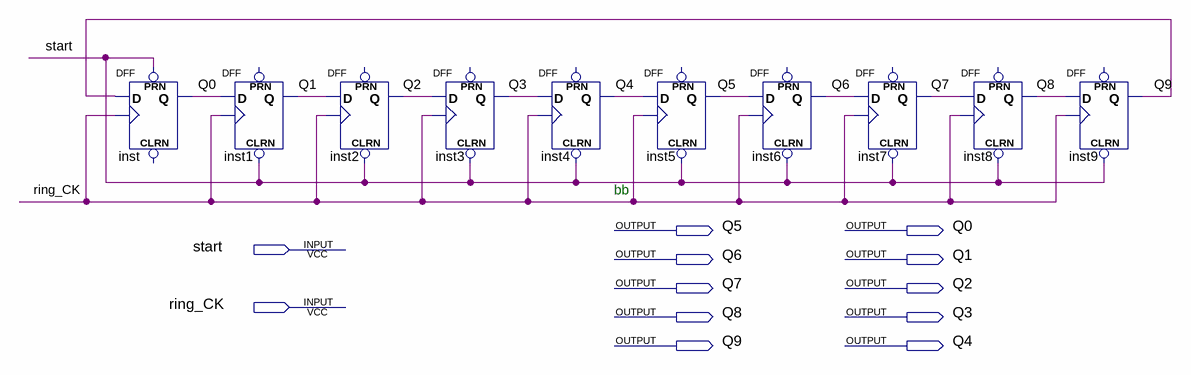
[diagram p0: schematic sheet]
// Quartus schematic 10_MOD_ring_D.bdf as structural Verilog: 10 symbols, 12 pins
module \10_MOD_ring_D  (
  input  start,
  input  ring_CK,
  output Q5,
  output Q0,
  output Q6,
  output Q1,
  output Q7,
  output Q2,
  output Q8,
  output Q3,
  output Q9,
  output Q4
);

  DFF inst (.CLK(ring_CK), .D(Q9), .PRN(start), .Q(Q0));  // open: CLRN
  DFF inst1 (.CLRN(start), .CLK(ring_CK), .D(Q0), .Q(Q1));  // open: PRN
  DFF inst2 (.CLRN(start), .CLK(ring_CK), .D(Q1), .Q(Q2));  // open: PRN
  DFF inst3 (.CLRN(start), .CLK(ring_CK), .D(Q2), .Q(Q3));  // open: PRN
  DFF inst4 (.CLRN(start), .CLK(ring_CK), .D(Q3), .Q(Q4));  // open: PRN
  DFF inst5 (.CLRN(start), .CLK(ring_CK), .D(Q4), .Q(Q5));  // open: PRN
  DFF inst6 (.CLRN(start), .CLK(ring_CK), .D(Q5), .Q(Q6));  // open: PRN
  DFF inst7 (.CLRN(start), .CLK(ring_CK), .D(Q6), .Q(Q7));  // open: PRN
  DFF inst8 (.CLRN(start), .CLK(ring_CK), .D(Q7), .Q(Q8));  // open: PRN
  DFF inst9 (.CLRN(start), .CLK(ring_CK), .D(Q8), .Q(Q9));  // open: PRN

  // Notes on the sheet:
  //   bb
endmodule
